# Altium project AirMeter.PrjPcb
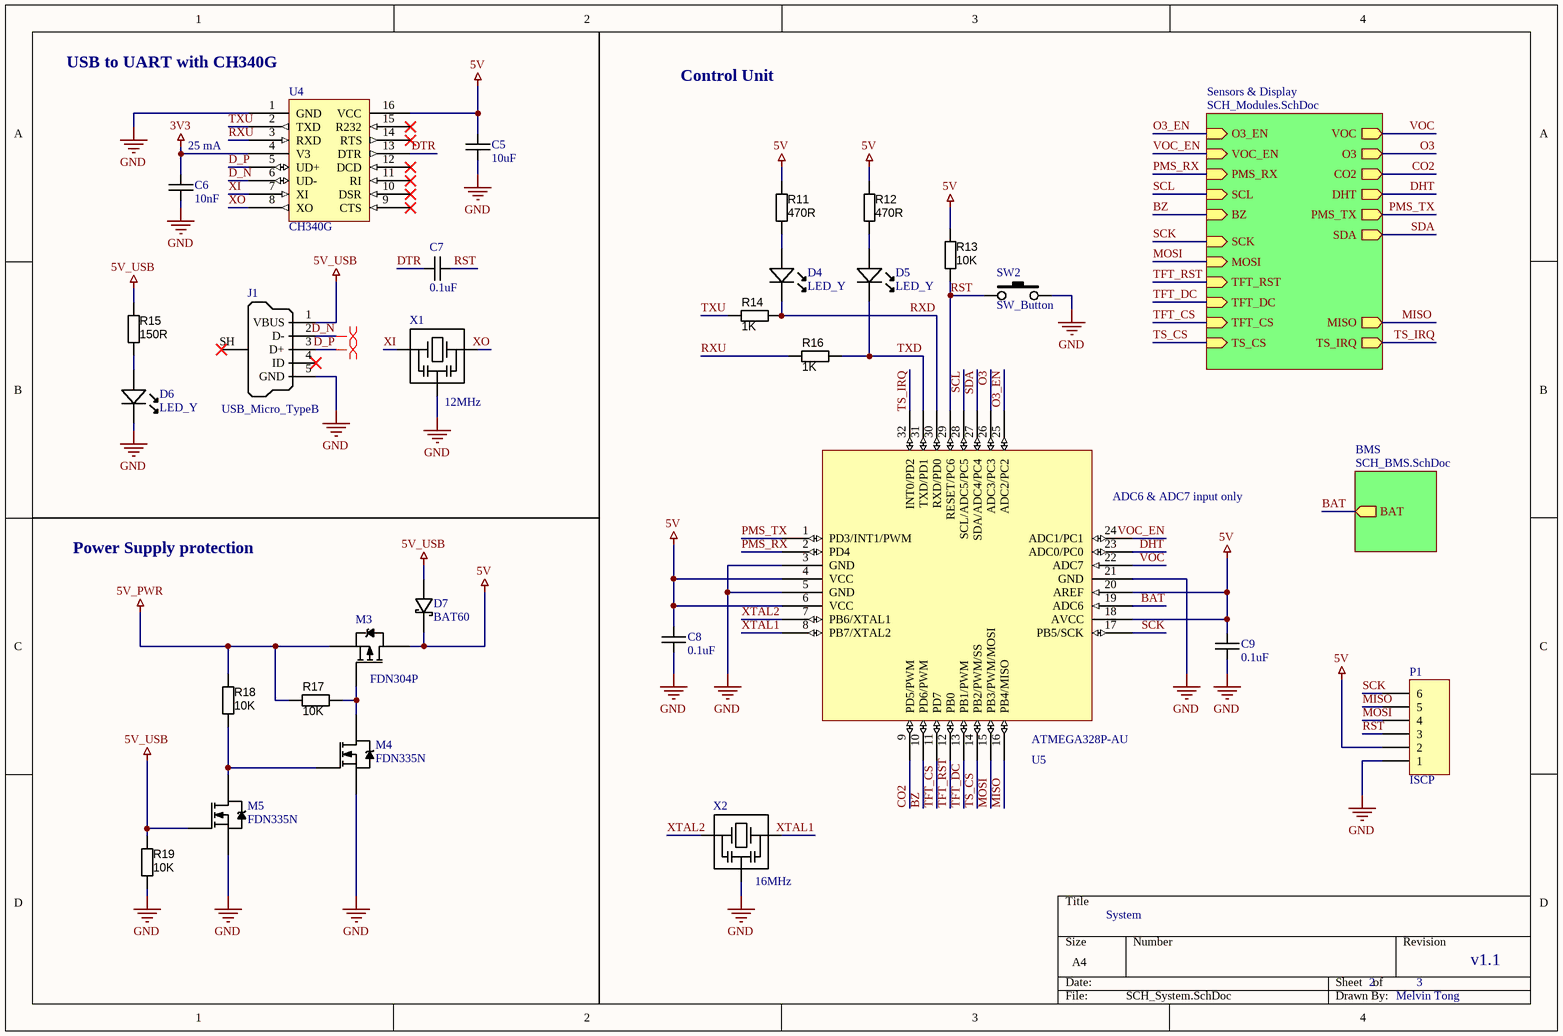
[diagram p0: SCH_System.SchDoc]
3 sheets, 87 parts. Net scope: hierarchical (ports join the sheet entries above them; power ports are global).
Board file: PCB_AirMeter.PcbDoc
Sheets:
  SCH_System.SchDoc
    BMS = SCH_BMS.SchDoc
    Sensors & Display = SCH_Modules.SchDoc

## Sheet SCH_System.SchDoc: System
size A4; Author: Melvin Tong; DrawnBy: Melvin Tong; Revision: v1.1; SheetNumber: 2; SheetTotal: 3

### Parts
C5  10uF  [CAP_0805]
C6  10nF  [CAP_0805]
C7  0.1uF  [CAP_0805]
C8  0.1uF  [CAP_0805]
C9  0.1uF  [CAP_0805]
D4  LED_Y  [LED_0805]
D5  LED_Y  [LED_0805]
D6  LED_Y  [LED_0805]
D7  BAT60  [SOD323]
J1  USB_Micro_TypeB  [USB_Micro_TypeB]
M3  FDN304P  [SOT23_213]
M4  FDN335N  [SOT23_213]
M5  FDN335N  [SOT23_213]
P1  ISCP  [HDR1X6]
R11  470R  [RESC3216X70N]
R12  470R  [RESC3216X70N]
R13  10K  [RESC3216X70N]
R14  1K  [RESC3216X70N]
R15  150R  [RESC3216X70N]
R16  1K  [RESC3216X70N]
R17  10K  [RESC3216X70N]
R18  10K  [RESC3216X70N]
R19  10K  [RESC3216X70N]
SW2  SW_Button  [Button_4x4x1.5]
U4  CH340G  [CH340G]
U5  ATMEGA328P-AU  [ATMEGA328P-AU]
X1  12MHz  [XTAL_3.2x1.6]
X2  16MHz  [XTAL_3.2x1.6]

### Sub-sheets
BMS = SCH_BMS.SchDoc: BAT (out)
Sensors & Display = SCH_Modules.SchDoc: CO2 (out), PMS_TX (out), PMS_RX (in), VOC (out), DHT (out), O3_EN (in), O3 (out), SDA (out), SCL (in), TFT_RST (in), TS_CS (in), TFT_DC (in), MOSI (in), TFT_CS (in), SCK (in), MISO (out), TS_IRQ (out), VOC_EN (in), BZ (in)

### Nets
3V3: C6.1 U4.4(V3)
5V: C5.1 C8.1 C9.1 D7.K M3.3(D) P1.2 R11.2 R12.1 R13.1 U4.16(VCC) U5.4(VCC) U5.6(VCC) U5.18(AVCC) U5.20(AREF)
5V_PWR: M3.2(S) R17.1 R18.1
5V_USB: D7.A J1.1(VBUS) M5.1(G) R15.1 R19.1
GND: C5.2 C6.2 C8.2 C9.2 D6.K J1.5(GND) M4.2(S) M5.2(S) P1.1 R19.2 SW2.2 U4.1(GND) U5.3(GND) U5.5(GND) U5.21(GND) X1.2(GND) X2.2(GND)
BAT: U5.19(ADC6) ; sheet BMS/BAT
BZ: U5.10(PD6/PWM) ; sheet Sensors & Display/BZ
CO2: U5.9(PD5/PWM) ; sheet Sensors & Display/CO2
D_N: J1.2(D-) U4.6(UD-)
D_P: J1.3(D+) U4.5(UD+)
DHT: U5.23(ADC0/PC0) ; sheet Sensors & Display/DHT
DTR: C7.1 U4.13(DTR)
MISO: P1.5 U5.16(PB4/MISO) ; sheet Sensors & Display/MISO
MOSI: P1.4 U5.15(PB3/PWM/MOSI) ; sheet Sensors & Display/MOSI
O3: U5.26(ADC3/PC3) ; sheet Sensors & Display/O3
O3_EN: U5.25(ADC2/PC2) ; sheet Sensors & Display/O3_EN
PMS_RX: U5.2(PD4) ; sheet Sensors & Display/PMS_RX
PMS_TX: U5.1(PD3/INT1/PWM) ; sheet Sensors & Display/PMS_TX
RST: C7.2 P1.3 R13.2 SW2.1 U5.29(RESET/PC6)
RXD: D4.K R14.2 U5.30(RXD/PD0)
RXU: R16.1 U4.3(RXD)
SCK: P1.6 U5.17(PB5/SCK) ; sheet Sensors & Display/SCK
SCL: U5.28(SCL/ADC5/PC5) ; sheet Sensors & Display/SCL
SDA: U5.27(SDA/ADC4/PC4) ; sheet Sensors & Display/SDA
TFT_CS: U5.11(PD7) ; sheet Sensors & Display/TFT_CS
TFT_DC: U5.13(PB1/PWM) ; sheet Sensors & Display/TFT_DC
TFT_RST: U5.12(PB0) ; sheet Sensors & Display/TFT_RST
TS_CS: U5.14(PB2/PWM/SS) ; sheet Sensors & Display/TS_CS
TS_IRQ: U5.32(INT0/PD2) ; sheet Sensors & Display/TS_IRQ
TXD: D5.K R16.2 U5.31(TXD/PD1)
TXU: R14.1 U4.2(TXD)
VOC: U5.22(ADC7) ; sheet Sensors & Display/VOC
VOC_EN: U5.24(ADC1/PC1) ; sheet Sensors & Display/VOC_EN
XI: U4.7(XI) X1.1(IN)
XO: U4.8(XO) X1.3(OUT)
XTAL1: U5.8(PB7/XTAL2) X2.3(OUT)
XTAL2: U5.7(PB6/XTAL1) X2.1(IN)
NetD4_A: D4.A R11.1
NetD5_A: D5.A R12.2
NetD6_A: D6.A R15.2
NetM3_1: M3.1(G) M4.3(D) R17.2
NetM4_1: M4.1(G) M5.3(D) R18.2

Not connected (* = marked no-connect by the designer): J1 4(ID)* SH(Shell)*; U4 9(CTS)* 10(DSR)* 11(RI)* 12(DCD)* 14(RTS)* 15(R232)*

### Layout directives
differential pair: D_N, D_P

### Notes on the sheet
- (near U4) USB to UART with CH340G
- Control Unit
- (near C6) 25 mA
- (near U5) ADC6 & ADC7 input only
- Power Supply protection

### Library data of the parts
C5 = CAP_10uF: SMD 0805
C6 = CAP_10nF: SMD 0805
C7-C9 = CAP_0.1uF: SMD 0805
D4-D6 = LED_Y: SMD_0805 2.4V
D7 = BAT60: Schottky Diode 3A, Vf~0.24V, Vr=10V
M3 = PMOS
M4 M5 = NMOS
P1 = Header 6: Header, 6-Pin; LatestRevisionDate: 17-Jul-2002; LatestRevisionNote: Re-released for DXP Platform.; Publisher: Altium Limited
R11 R12 = RES_470R: Resistor SMD, 1206; Value: N/A
R13 R17-R19 = RES_10K: Resistor SMD, 1206; Value: N/A
R14 R16 = RES_1K: Resistor SMD, 1206; Value: N/A
R15 = RES_150R: Resistor SMD, 1206; Value: N/A
X1 = 12MHz: Crystal Oscillator
X2 = 16MHz: Crystal Oscillator

## Sheet SCH_BMS.SchDoc: Battery Management System
size A4; DrawnBy: Melvin Tong; Revision: v1.1; SheetNumber: 1; SheetTotal: 3
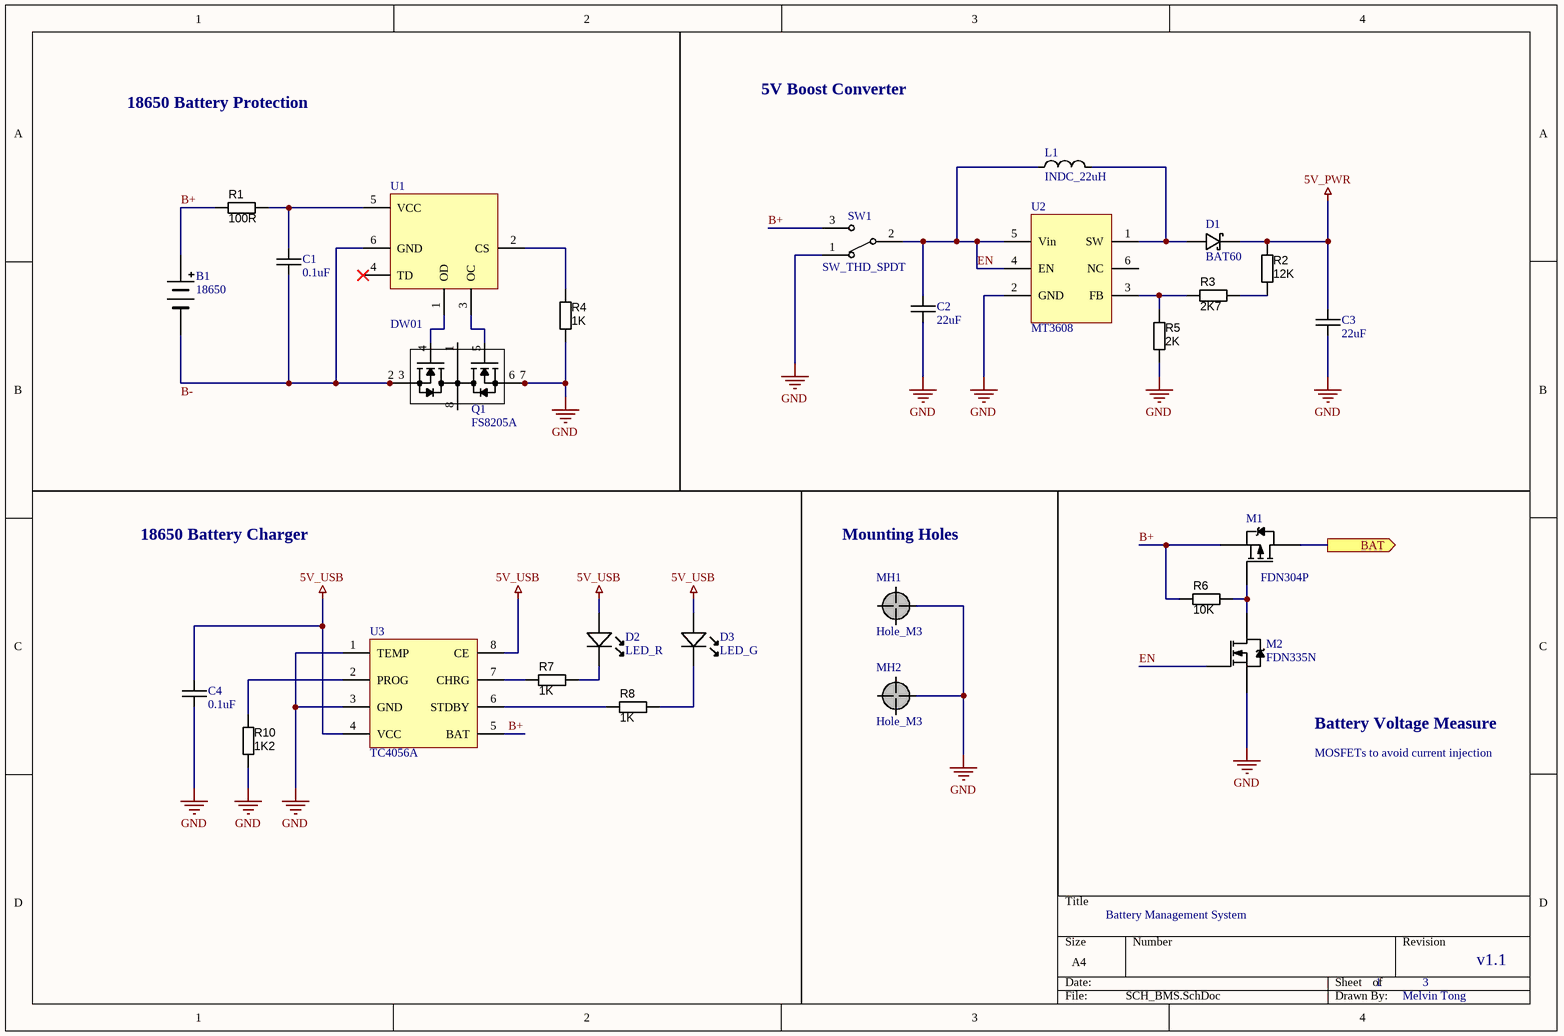
[diagram p1: SCH_BMS.SchDoc]

### Parts
B1  18650  [BAT_18650]
C1  0.1uF  [CAP_0805]
C2  22uF  [CAP_1206]
C3  22uF  [CAP_1206]
C4  0.1uF  [CAP_0805]
D1  BAT60  [SOD323]
D2  LED_R  [LED_0805]
D3  LED_G  [LED_0805]
L1  INDC_22uH  [IND_10x10]
M1  FDN304P  [SOT23_213]
M2  FDN335N  [SOT23_213]
MH1  Hole_M3  [Hole_M3]
MH2  Hole_M3  [Hole_M3]
Q1  FS8205A  [TSSOP65P640X120-8N]
R1  100R  [RESC3216X70N]
R2  12K  [RESC3216X70N]
R3  2K7  [RESC3216X70N]
R4  1K  [RESC3216X70N]
R5  2K  [RESC3216X70N]
R6  10K  [RESC3216X70N]
R7  1K  [RESC3216X70N]
R8  1K  [RESC3216X70N]
R10  1K2  [RESC3216X70N]
SW1  SW_THD_SPDT  [3P_header]
U1  DW01  [SOT23-6]
U2  MT3608  [SOT23-6]
U3  TC4056A  [SOIC127P600X175-8AN]

### Ports
BAT (out)

### Nets
5V_PWR: C3.1 D1.K R2.1
5V_USB: C4.1 D2.A D3.A U3.4(VCC) U3.8(CE)
GND: C2.2 C3.2 C4.2 M2.2(S) MH1.MH MH2.MH Q1.6(S1) Q1.7(S1) R4.2 R5.1 R10.2 SW1.1 U2.2(GND) U3.1(TEMP) U3.3(GND)
B+: B1.1(B+) M1.2(S) R1.1 R6.1 SW1.3 U3.5(BAT)
B-: B1.2(B+) C1.2 Q1.2(S1) Q1.3(S1) U1.6(GND)
BAT: M1.3(D) ; port BAT
EN: C2.1 L1.1 M2.1(G) SW1.2 U2.4(EN) U2.5(Vin)
NetC1_1: C1.1 R1.2 U1.5(VCC)
NetD1_A: D1.A L1.2 U2.1(SW)
NetD2_K: D2.K R7.2
NetD3_K: D3.K R8.2
NetM1_1: M1.1(G) M2.3(D) R6.2
NetQ1_4: Q1.4(G1) U1.1(OD)
NetQ1_5: Q1.5(G2) U1.3(OC)
NetR2_2: R2.2 R3.2
NetR3_1: R3.1 R5.2 U2.3(FB)
NetR4_1: R4.1 U1.2(CS)
NetR7_1: R7.1 U3.7(CHRG)
NetR8_1: R8.1 U3.6(STDBY)
NetR10_1: R10.1 U3.2(PROG)

Not connected (* = marked no-connect by the designer): Q1 1(D12) 8(D12); U1 4(TD)*; U2 6(NC)

### Notes on the sheet
- 18650 Battery Protection
- 5V Boost Converter
- 18650 Battery Charger
- Mounting Holes
- Battery Voltage Measure
- MOSFETs to avoid current injection

### Library data of the parts
B1 = Battery_18650
C1 C4 = CAP_0.1uF: SMD 0805
C2 C3 = CAP_22uF: SMD 1206
D1 = BAT60: Schottky Diode 3A, Vf~0.24V, Vr=10V
D2 = LED_R: SMD_0805 2V
D3 = LED_G: SMD_0805 3V
M1 = PMOS
M2 = NMOS
Q1 = FS8205A: NMOS, Drain-Connected, Imax 6A
R1 = RES_100R: Resistor SMD, 1206; Value: N/A
R2 = RES_12K: Resistor SMD, 1206; Value: N/A
R3 = RES_2K7: Resistor SMD, 1206; Value: N/A
R4 R7 R8 = RES_1K: Resistor SMD, 1206; Value: N/A
R5 = RES_2K: Resistor SMD, 1206; Value: N/A
R6 = RES_10K: Resistor SMD, 1206; Value: N/A
R10 = RES_1K2: Resistor SMD, 1206; Value: N/A
SW1 = SW_THD_SPDT: Switch 2 position
U2 = MT3608: Boost Converter

## Sheet SCH_Modules.SchDoc: Modules
size A4; DrawnBy: Melvin Tong; Revision: v1.1; SheetNumber: 3; SheetTotal: 3
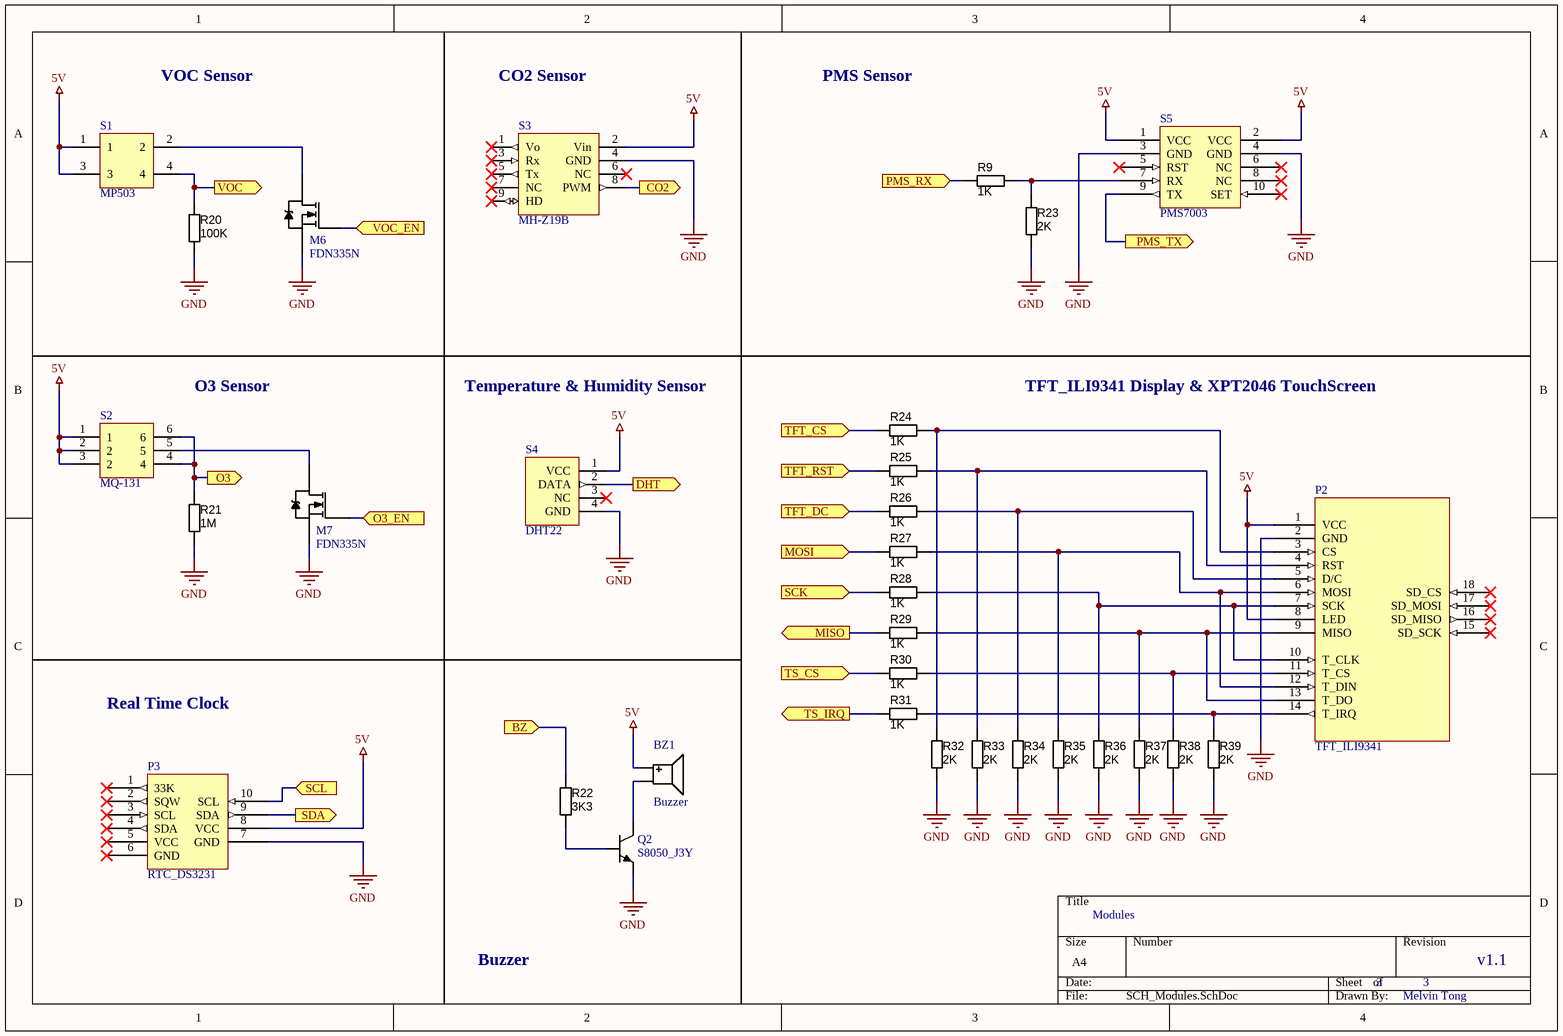
[diagram p2: SCH_Modules.SchDoc]

### Parts
BZ1  Buzzer  [BZ_12085]
M6  FDN335N  [SOT23_213]
M7  FDN335N  [SOT23_213]
P2  TFT_ILI9341  [TFT_ILI9341]
P3  RTC_DS3231  [DS3231 RTC]
Q2  S8050_J3Y  [SOT23_213]
R9  1K  [RESC3216X70N]
R20  100K  [RESC3216X70N]
R21  1M  [RESC3216X70N]
R22  3K3  [RESC3216X70N]
R23  2K  [RESC3216X70N]
R24  1K  [RESC3216X70N]
R25  1K  [RESC3216X70N]
R26  1K  [RESC3216X70N]
R27  1K  [RESC3216X70N]
R28  1K  [RESC3216X70N]
R29  1K  [RESC3216X70N]
R30  1K  [RESC3216X70N]
R31  1K  [RESC3216X70N]
R32  2K  [RESC3216X70N]
R33  2K  [RESC3216X70N]
R34  2K  [RESC3216X70N]
R35  2K  [RESC3216X70N]
R36  2K  [RESC3216X70N]
R37  2K  [RESC3216X70N]
R38  2K  [RESC3216X70N]
R39  2K  [RESC3216X70N]
S1  MP503  [MP503 VOC Sensor]
S2  MQ-131  [MQ-131 Ozone Sensor]
S3  MH-Z19B  [MH-Z19B CO2 Sensor]
S4  DHT22  [DHT22]
S5  PMS7003  [PMS7003]

### Ports
BZ (in), CO2 (out), DHT (out), MISO (out), MOSI (in), O3 (out), O3_EN (in), PMS_RX (in), PMS_TX (out), SCK (in), SCL (in), SDA (out), TFT_CS (in), TFT_DC (in), TFT_RST (in), TS_CS (in), TS_IRQ (out), VOC (out), VOC_EN (in)

### Nets
5V: BZ1.1(Positive) P2.1(VCC) P2.8(LED) P3.8(VCC) S1.1 S1.3 S2.1 S2.2 S2.3(2) S3.2(Vin) S4.1(VCC) S5.1(VCC) S5.2(VCC)
GND: M6.2(S) M7.2(S) P2.2(GND) P3.7(GND) Q2.2(E) R20.2 R21.2 R23.2 R32.2 R33.2 R34.2 R35.2 R36.2 R37.2 R38.2 R39.2 S3.4(GND) S4.4(GND) S5.3(GND) S5.4(GND)
BZ: R22.1 ; port BZ
CO2: S3.8(PWM) ; port CO2
DHT: S4.2(DATA) ; port DHT
MISO: R29.1 ; port MISO
MOSI: R27.1 ; port MOSI
O3: R21.1 S2.4 S2.6 ; port O3
O3_EN: M7.1(G) ; port O3_EN
PMS_RX: R9.1 ; port PMS_RX
PMS_TX: S5.9(TX) ; port PMS_TX
SCK: R28.1 ; port SCK
SCL: P3.10(SCL) ; port SCL
SDA: P3.9(SDA) ; port SDA
TFT_CS: R24.1 ; port TFT_CS
TFT_DC: R26.1 ; port TFT_DC
TFT_RST: R25.1 ; port TFT_RST
TS_CS: R30.1 ; port TS_CS
TS_IRQ: R31.1 ; port TS_IRQ
VOC: R20.1 S1.4 ; port VOC
VOC_EN: M6.1(G) ; port VOC_EN
NetBZ1_2: BZ1.2(Negative) Q2.3(C)
NetM6_3: M6.3(D) S1.2
NetM7_3: M7.3(D) S2.5
NetP2_3: P2.3(CS) R24.2 R32.1
NetP2_4: P2.4(RST) R25.2 R33.1
NetP2_5: P2.5(D/C) R26.2 R34.1
NetP2_6: P2.6(MOSI) P2.12(T_DIN) R27.2 R35.1
NetP2_7: P2.7(SCK) P2.10(T_CLK) R28.2 R36.1
NetP2_9: P2.9(MISO) P2.13(T_DO) R29.2 R37.1
NetP2_11: P2.11(T_CS) R30.2 R38.1
NetP2_14: P2.14(T_IRQ) R31.2 R39.1
NetQ2_1: Q2.1(B) R22.2
NetR9_2: R9.2 R23.1 S5.7(RX)

Not connected (* = marked no-connect by the designer): P2 15(SD_SCK)* 16(SD_MISO)* 17(SD_MOSI)* 18(SD_CS)*; P3 1(33K)* 2(SQW)* 3(SCL)* 4(SDA)* 5(VCC)* 6(GND)*; S3 1(Vo)* 3(Rx)* 5(Tx)* 6(NC)* 7(NC)* 9(HD)*; S4 3(NC)*; S5 5(RST)* 6(NC)* 8(NC)* 10(SET)*

### Notes on the sheet
- VOC Sensor
- CO2 Sensor
- PMS Sensor
- O3 Sensor
- Temperature & Humidity Sensor
- TFT_ILI9341 Display & XPT2046 TouchScreen
- Real Time Clock
- Buzzer

### Library data of the parts
BZ1 = Buzzer: Buzzer passive 5 VAC
M6 M7 = NMOS
P3 = RTC_DS3231: Real Time Clock
Q2 = NPN
R9 R24-R31 = RES_1K: Resistor SMD, 1206; Value: N/A
R20 = RES_100K: Resistor SMD, 1206; Value: N/A
R21 = RES_1M: Resistor SMD, 1206; Value: N/A
R22 = RES_3K3: Resistor SMD, 1206; Value: N/A
R23 R32-R39 = RES_2K: Resistor SMD, 1206; Value: N/A
S1 = MP503: VOC Sensor
S2 = MQ-131: Ozone Sensor
S3 = MH-Z19B: CO2 Sensor
S5 = PMS7003: Particle air sensor. 1um, 2.5um, 10um

## Nets that join several sheets
5V: SCH_System (14 pins), SCH_Modules (13 pins)
5V_PWR: SCH_System (M3.2 R17.1 R18.1), SCH_BMS (C3.1 D1.K R2.1)
5V_USB: SCH_System (5 pins), SCH_BMS (5 pins)
GND: SCH_System (17 pins), SCH_BMS (15 pins), SCH_Modules (20 pins)
BAT: SCH_System (U5.19), SCH_BMS (M1.3)
BZ: SCH_System (U5.10), SCH_Modules (R22.1)
CO2: SCH_System (U5.9), SCH_Modules (S3.8)
DHT: SCH_System (U5.23), SCH_Modules (S4.2)
MISO: SCH_System (P1.5 U5.16), SCH_Modules (R29.1)
MOSI: SCH_System (P1.4 U5.15), SCH_Modules (R27.1)
O3: SCH_System (U5.26), SCH_Modules (R21.1 S2.4 S2.6)
O3_EN: SCH_System (U5.25), SCH_Modules (M7.1)
PMS_RX: SCH_System (U5.2), SCH_Modules (R9.1)
PMS_TX: SCH_System (U5.1), SCH_Modules (S5.9)
SCK: SCH_System (P1.6 U5.17), SCH_Modules (R28.1)
SCL: SCH_System (U5.28), SCH_Modules (P3.10)
SDA: SCH_System (U5.27), SCH_Modules (P3.9)
TFT_CS: SCH_System (U5.11), SCH_Modules (R24.1)
TFT_DC: SCH_System (U5.13), SCH_Modules (R26.1)
TFT_RST: SCH_System (U5.12), SCH_Modules (R25.1)
TS_CS: SCH_System (U5.14), SCH_Modules (R30.1)
TS_IRQ: SCH_System (U5.32), SCH_Modules (R31.1)
VOC: SCH_System (U5.22), SCH_Modules (R20.1 S1.4)
VOC_EN: SCH_System (U5.24), SCH_Modules (M6.1)